# Altium schematic sheet DIRECTIONAL_COUPLER.SchDoc
size A4
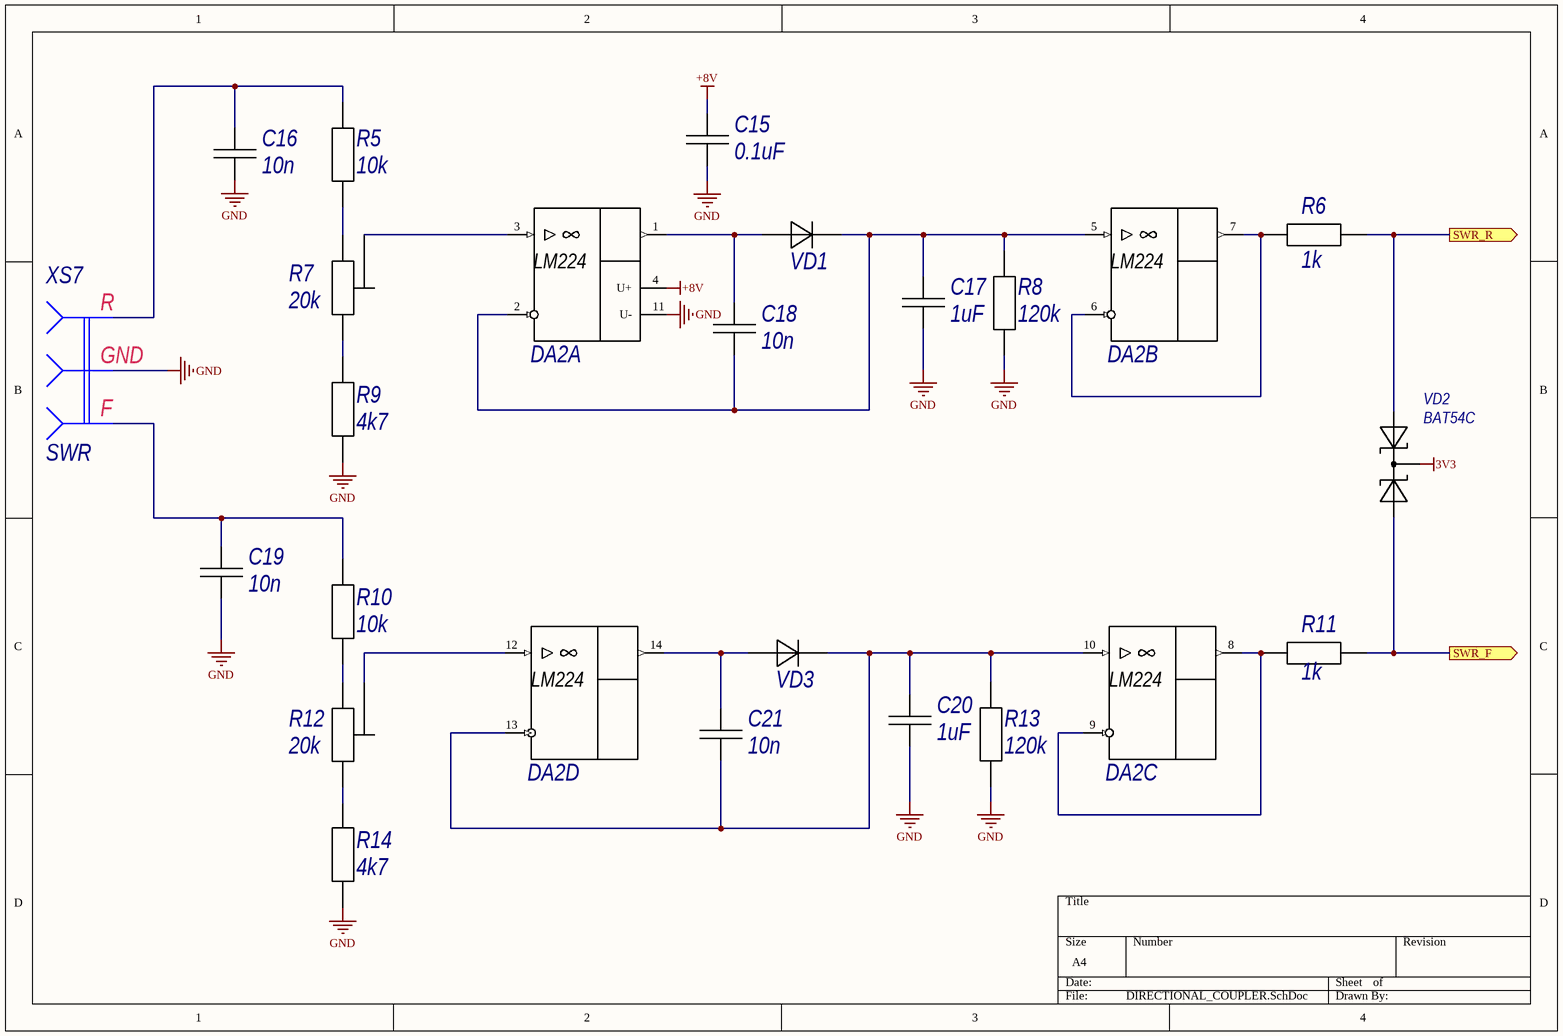
[diagram p0: DIRECTIONAL_COUPLER.SchDoc]

## Parts
C15  0.1uF  [C0805C]
C16  10n  [C0805C]
C17  1uF  [C0805C]
C18  10n  [C0805C]
C19  10n  [C0805C]
C20  1uF  [C0805C]
C21  10n  [C0805C]
DA2  LM224  [Texas_Instruments_D0014A_IPC_A]  (value not drawn)  (parts A,B,C,D of 4)
R5  10k  [C0805R]
R6  1k  [C0805R]
R7  20k  [TRIM_3296W-1-254LF]
R8  120k  [C0805R]
R9  4k7  [C0805R]
R10  10k  [C0805R]
R11  1k  [C0805R]
R12  20k  [TRIM_3296W-1-254LF]
R13  120k  [C0805R]
R14  4k7  [C0805R]
VD1  LL4148  [DIO_LL4148]  (value not drawn)
VD2  BAT54C  [BAT54C_SOT23-3]
VD3  LL4148  [DIO_LL4148]  (value not drawn)
XS7  SWR  [YX-XH-3]

## Ports
SWR_F (out), SWR_R (out)

## Nets
3V3: VD2.3(AC)
+8V: C15.2 DA2.4(U+)
GND: C15.1 C16.1 C17.1 C19.1 C20.1 DA2.11(U-) R8.2 R9.1 R13.1 R14.1 XS7.2
SWR_F: R11.1 VD2.2(C) ; port SWR_F
SWR_R: R6.1 VD2.1(А1) ; port SWR_R
NetC16_2: C16.2 R5.2 XS7.1
NetC17_2: C17.2 C18.1 DA2.2(IN-) DA2.5(IN+) R8.1 VD1.2(К)
NetC18_2: C18.2 DA2.1(OUT) VD1.1(А)
NetC19_2: C19.2 R10.2 XS7.3
NetC20_2: C20.2 C21.1 DA2.10(IN+) DA2.13(IN-) R13.2 VD3.2(К)
NetC21_2: C21.2 DA2.14(OUT) VD3.1(А)
NetDA2_3: DA2.3(IN+) R7.2
NetDA2_6: DA2.6(IN-) DA2.7(OUT) R6.2
NetDA2_8: DA2.8(OUT) DA2.9(IN-) R11.2
NetDA2_12: DA2.12(IN+) R12.2
NetR5_1: R5.1 R7.1
NetR7_3: R7.3 R9.2
NetR10_1: R10.1 R12.1
NetR12_3: R12.3 R14.2

## Notes on the sheet
- (in symbol DIR_COUP) R; GND; F

## Library data of the parts
C15-C21 = CAP_0805: Type: Конденсатор; Published: 18.05.2010; Publisher: Andrew Danich
R5 R6 R8-R11 R13 R14 = RES_0805: Published: 24.03.2010; Publisher: Andrew Danich; Type: Резистор
R7 R12 = Resistor-Trimmer-1: Publisher: Andrew Danich; Type: Подстроечный резистор; Published: 27.07.2015
VD1 VD3 = LL4148: Type: Диод; Published: 18.05.2010; Publisher: Andrew Danich
VD2 = BAT54C: Small Signal Schottky Diode, Dual Common Cathode, 30 V, 200 mA, 400 mV, 600 mA, 125 C
XS7 = DIR_COUP: Published: 07.03.2013; Publisher: Andrew Danich; Type: Розетка
DA2 = LM224: Published: 29.07.2015; Publisher: Andrew Danich; Type: Микросхема